# EAGLE design SparkX_EZ_ESP32 (EAGLE 9.6.2)
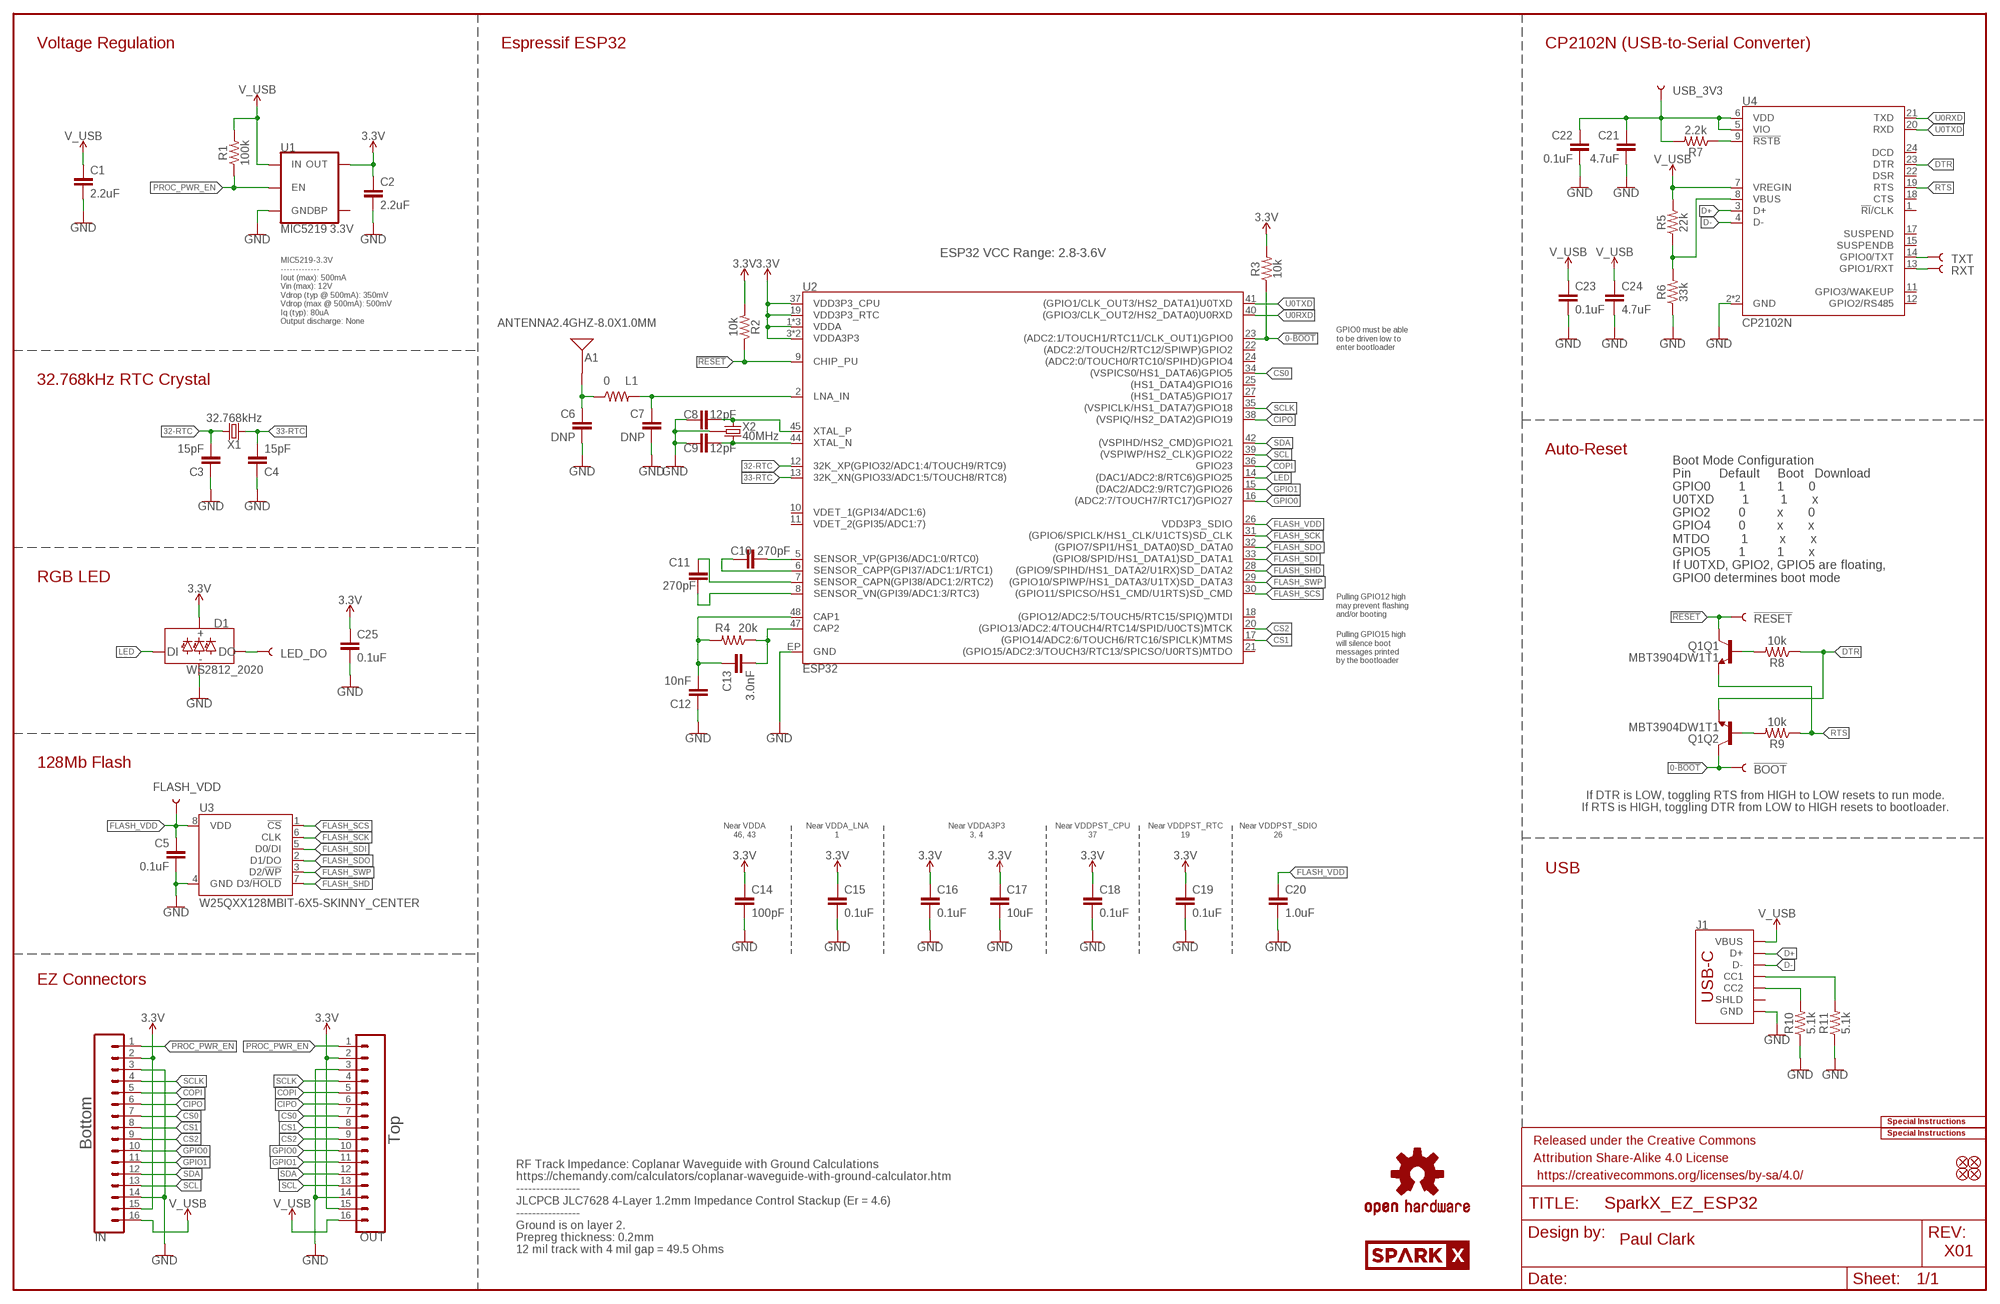
[diagram p0: schematic, sheet 1]

## Parts
!BOOT!  TEST-POINT3X4  [PAD.03X.04]
!RESET!  TEST-POINT3X4  [PAD.03X.04]
A1  ANTENNA2.4GHZ-8.0X1.0MM  [ANT-2.4GHZ-8.0X1.0MM]
C1  2.2uF  2.2UF-0402_TIGHT-10V-10%-X5R  [0402-TIGHT]
C2  2.2uF  2.2UF-0402_TIGHT-10V-10%-X5R  [0402-TIGHT]
C3  15pF  15PF-0402T-50V-5%  [0402-TIGHT]
C4  15pF  15PF-0402T-50V-5%  [0402-TIGHT]
C5  0.1uF  0.1UF-0402T-6.3V-10%-X7R  [0402-TIGHT]
C6  DNP  CAP-0402-TIGHT  [0402-TIGHT]
C7  DNP  CAP-0402-TIGHT  [0402-TIGHT]
C8  12pF  12PF-0402T-50V-5%  [0402-TIGHT]
C9  12pF  12PF-0402T-50V-5%  [0402-TIGHT]
C10  270pF  270PF-0402T-50V-5%  [0402-TIGHT]
C11  270pF  270PF-0402T-50V-5%  [0402-TIGHT]
C12  10nF  10NF-0402T-25V-10%  [0402-TIGHT]
C13  3.0nF  3.0NF-0402T-50V-5%  [0402-TIGHT]
C14  100pF  100PF-0402T-50V-5%  [0402-TIGHT]
C15  0.1uF  0.1UF-0402T-16V-10%  [0402-TIGHT]
C16  0.1uF  0.1UF-0402T-16V-10%  [0402-TIGHT]
C17  10uF  10UF-0402T-6.3V-20%  [0402-TIGHT]
C18  0.1uF  0.1UF-0402T-16V-10%  [0402-TIGHT]
C19  0.1uF  0.1UF-0402T-16V-10%  [0402-TIGHT]
C20  1.0uF  1.0UF-0402T-16V-10%  [0402-TIGHT]
C21  4.7uF  4.7UF-0402_TIGHT-6.3V-20%-X5R  [0402-TIGHT]
C22  0.1uF  0.1UF-0402T-6.3V-10%-X7R  [0402-TIGHT]
C23  0.1uF  0.1UF-0402T-6.3V-10%-X7R  [0402-TIGHT]
C24  4.7uF  4.7UF-0402_TIGHT-6.3V-20%-X5R  [0402-TIGHT]
C25  0.1uF  0.1UF-0402T-16V-10%  [0402-TIGHT]
D1  WS2812_2020  [WS2812-2020]
FD1  FIDUCIALUFIDUCIAL  [FIDUCIAL-MICRO]
FD2  FIDUCIALUFIDUCIAL  [FIDUCIAL-MICRO]
FD3  FIDUCIALUFIDUCIAL  [FIDUCIAL-MICRO]
FD4  FIDUCIALUFIDUCIAL  [FIDUCIAL-MICRO]
FLASH_VDD  TEST-POINT3X4  [PAD.03X.04]
FRAME1  FRAME-LEDGER  [CREATIVE_COMMONS]
IN  CONN_16FPC_16_0.5MM  [FPC_16_0.5MM]
J1  USB_C_4-LAYER_PADS  [USB-C-16P_4LAYER-PADS]
L1  0  0OHM-0402T-1/10W  [0402-TIGHT]
LED_DO  TEST-POINT3X4  [PAD.03X.04]
LOGO1  SPECIAL_INSTRUCTIONS-ORDERING  [ORDERING_INSTRUCTIONS]
LOGO2  OSHW-LOGOMINI  [OSHW-LOGO-MINI]
LOGO3  OSHW-LOGOMINI  [OSHW-LOGO-MINI]
LOGO4  SPECIAL_INSTRUCTIONS-PRODUCTION  [PRODUCTION_INSTRUCTIONS]
OUT  CONN_16FPC_16_0.5MM  [FPC_16_0.5MM]
Q1  MBT3904DW1T1  TRANS_NPN_DUAL-MBT3904DW1T1  [SC70-6]
R1  100k  100KOHM-0402T-1/16W-1%  [0402-TIGHT]
R2  10k  10KOHM-0402T-1/16W-1%  [0402-TIGHT]
R3  10k  10KOHM-0402T-1/16W-1%  [0402-TIGHT]
R4  20k  20KOHM-0402T-1/16W-1%  [0402-TIGHT]
R5  22k  22KOHM-0402_TIGHT-1/10W-1%  [0402-TIGHT]
R6  33k  33KOHM-0402T-1/16W-1%  [0402-TIGHT]
R7  2.2k  2.2KOHM-0402T-1/16W-1%  [0402-TIGHT]
R8  10k  10KOHM-0402T-1/16W-1%  [0402-TIGHT]
R9  10k  10KOHM-0402T-1/16W-1%  [0402-TIGHT]
R10  5.1k  5.1KOHM-0402T-1/16W-1%  [0402-TIGHT]
R11  5.1k  5.1KOHM-0402T-1/16W-1%  [0402-TIGHT]
RXT  TEST-POINT3X4  [PAD.03X.04]
TXT  TEST-POINT3X4  [PAD.03X.04]
U1  MIC5219 3.3V  V_REG_MIC52193.3V  [SOT23-5]
U2  ESP32  [QFN48-0.4MM]
U3  W25QXX128MBIT-6X5-SKINNY_CENTER  [WSON-8-6X5-SKINNY_CENTERPAD]
U4  CP2102N  [QFN24]
U$1  SPARKX-LOGO3  [SPARKX-SMALL]
U$4  SPARKX-LOGO3  [SPARKX-SMALL]
USB_3V3  TEST-POINT3X4  [PAD.03X.04]
X1  32.768kHz  CRYSTAL-32.768KHZSMD-3.2X1.5  [CRYSTAL-SMD-3.2X1.5MM]
X2  40MHz  CRYSTAL-40MHZ-SMD-2X2.5MM  [CRYSTAL-SMD-2X2.5MM]

## Nets
0-!BOOT!: !BOOT!.1 Q1.6(Q2:C) R3.1 U2.23((ADC2:1/TOUCH1/RTC11/CLK_OUT1)GPIO0)
1: C11.1 U2.7(SENSOR_CAPN(GPI38/ADC1:2/RTC2))
3: C10.2 U2.5(SENSOR_VP(GPI36/ADC1:0/RTC0))
3.3V: C2.1 C14.1 C15.1 C16.1 C17.1 C18.1 C19.1 C25.1 D1.VCC IN.2 IN.15 OUT.2 OUT.15 R2.2 R3.2 U1.5(OUT) U2.1(VDDA) U2.3(VDDA3P3) U2.4(VDDA3P3) U2.19(VDD3P3_RTC) U2.37(VDD3P3_CPU) U2.43(VDDA) U2.46(VDDA)
6: C10.1 U2.6(SENSOR_CAPP(GPI37/ADC1:1/RTC1))
32-RTC: C3.2 U2.12(32K_XP(GPIO32/ADC1:4/TOUCH9/RTC9)) X1.P$1
33-RTC: C4.2 U2.13(32K_XN(GPIO33/ADC1:5/TOUCH8/RTC8)) X1.P$2
!RESET: !RESET!.1 Q1.3(Q1:C) R2.1 U2.9(CHIP_PU)
CAP_10N1: C12.2 C13.1 R4.2 U2.48(CAP1)
CIPO: IN.6 OUT.6 U2.38((VSPIQ/HS2_DATA2)GPIO19)
COPI: IN.5 OUT.5 U2.36(GPIO23)
CS0: IN.7 OUT.7 U2.34((VSPICS0/HS1_DATA6)GPIO5)
CS1: IN.8 OUT.8 U2.17((GPIO14/ADC2:6/TOUCH6/RTC16/SPICLK)MTMS)
CS2: IN.9 OUT.9 U2.20((GPIO13/ADC2:4/TOUCH4/RTC14/SPID/U0CTS)MTCK)
D+: J1.A6(D+) J1.B6(D+) U4.3(D+)
D-: J1.A7(D-) J1.B7(D-) U4.4(D-)
DTR: Q1.1(Q2:E) R8.1 U4.23(DTR)
FLASH_SCK: U2.31((GPIO6/SPICLK/HS1_CLK/U1CTS)SD_CLK) U3.6(CLK)
FLASH_SCS: U2.30((GPIO11/SPICSO/HS1_CMD/U1RTS)SD_CMD) U3.1(!CS!)
FLASH_SDI: U2.33((GPIO8/SPID/HS1_DATA1)SD_DATA1) U3.5(D0/DI)
FLASH_SDO: U2.32((GPIO7/SPI1/HS1_DATA0)SD_DATA0) U3.2(D1/DO)
FLASH_SHD: U2.28((GPIO9/SPIHD/HS1_DATA2/U1RX)SD_DATA2) U3.7(D3/!HOLD!)
FLASH_SWP: U2.29((GPIO10/SPIWP/HS1_DATA3/U1TX)SD_DATA3) U3.3(D2/!WP!)
FLASH_VDD: C5.1 C20.1 FLASH_VDD.1 U2.26(VDD3P3_SDIO) U3.8(VDD)
GND: C1.2 C2.2 C3.1 C4.1 C5.2 C6.2 C7.2 C8.1 C9.1 C12.1 C14.2 C15.2 C16.2 C17.2 C18.2 C19.2 C20.2 C21.2 C22.2 C23.2 C24.2 C25.2 D1.GND IN.3 IN.14 J1.GND J1.GND2(GND) OUT.3 OUT.14 R6.1 R10.1 R11.1 U1.2(GND) U2.EP(GND) U3.4(GND) U4.2(GND) U4.PAD(GND) X2.P2(GND) X2.P4(GND)
GPIO0: IN.10 OUT.10 U2.16((ADC2:7/TOUCH7/RTC17)GPIO27)
GPIO1: IN.11 OUT.11 U2.15((DAC2/ADC2:9/RTC7)GPIO26)
LED: D1.DI U2.14((DAC1/ADC2:8/RTC6)GPIO25)
N$1: J1.A5(CC1) R11.2
N$2: J1.B5(CC2) R10.2
N$3: C11.2 U2.8(SENSOR_VN(GPI39/ADC1:3/RTC3))
N$4: D1.DO LED_DO.1
N$45: Q1.5(Q1:B) R8.2
N$46: Q1.2(Q2:B) R9.2
N$47: C8.2 U2.45(XTAL_P) X2.P1
N$48: C9.2 U2.44(XTAL_N) X2.P3
N$50: C13.2 R4.1 U2.47(CAP2)
N$51: R5.1 R6.2 U4.8(VBUS)
N$52: R7.1 U4.9(!RSTB)
N$53: A1.FEED(SIGNAL) C6.1 L1.1
N$54: C7.1 L1.2 U2.2(LNA_IN)
PROC_PWR_EN: IN.1 OUT.1 R1.1 U1.3(EN)
RTS: Q1.4(Q1:E) R9.1 U4.19(RTS)
RXT: RXT.1 U4.13(GPIO1/RXT)
SCL: IN.13 OUT.13 U2.39((VSPIWP/HS2_CLK)GPIO22)
SCLK: IN.4 OUT.4 U2.35((VSPICLK/HS1_DATA7)GPIO18)
SDA: IN.12 OUT.12 U2.42((VSPIHD/HS2_CMD)GPIO21)
TXT: TXT.1 U4.14(GPIO0/TXT)
U0RXD: U2.40((GPIO3/CLK_OUT2/HS2_DATA0)U0RXD) U4.21(TXD)
U0TXD: U2.41((GPIO1/CLK_OUT3/HS2_DATA1)U0TXD) U4.20(RXD)
USB_3V3: C21.1 C22.1 R7.2 U4.5(VIO) U4.6(VDD) USB_3V3.1
V_USB: C1.1 C23.1 C24.1 IN.16 J1.VBUS1(VBUS) J1.VBUS2(VBUS) OUT.16 R1.2 R5.2 U1.1(IN) U4.7(VREGIN)
Unconnected: J1.SHLD1(SHLD) J1.SHLD2(SHLD) J1.SHLD3(SHLD) J1.SHLD4(SHLD) U1.4(BP) U2.10(VDET_1(GPI34/ADC1:6)) U2.11(VDET_2(GPI35/ADC1:7)) U2.18((GPIO12/ADC2:5/TOUCH5/RTC15/SPIQ)MTDI) U2.21((GPIO15/ADC2:3/TOUCH3/RTC13/SPICSO/U0RTS)MTDO) U2.22((ADC2:2/TOUCH2/RTC12/SPIWP)GPIO2) U2.24((ADC2:0/TOUCH0/RTC10/SPIHD)GPIO4) U2.25((HS1_DATA4)GPIO16) U2.27((HS1_DATA5)GPIO17) U4.1(!RI!/CLK) U4.11(GPIO3/WAKEUP) U4.12(GPIO2/RS485) U4.15(SUSPENDB) U4.17(SUSPEND) U4.18(CTS) U4.22(DSR) U4.24(DCD)

## Notes on the sheet
- Voltage Regulation | Espressif ESP32 | CP2102N (USB-to-Serial Converter)
- MIC5219-3.3V
  -------------
  Iout (max): 500mA 
  Vin (max): 12V
  Vdrop (typ @ 500mA): 350mV
  Vdrop (max @ 500mA): 500mV
  Iq (typ): 80uA
  Output discharge: None
- ESP32 VCC Range: 2.8-3.6V
- GPIO0 must be able
  to be driven low to 
  enter bootloader
- 32.768kHz RTC Crystal
- Auto-Reset
- RGB LED
- Boot Mode Configuration
  Pin        Default     Boot   Download
  GPIO0        1         1       0
  U0TXD        1         1       x
  GPIO2        0         x       0
  GPIO4        0         x       x
  MTDO         1         x       x
  GPIO5        1         1       x
  If U0TXD, GPIO2, GPIO5 are floating, 
  GPIO0 determines boot mode
- Pulling GPIO12 high
  may prevent flashing
  and/or booting
- Pulling GPIO15 high
  will silence boot
  messages printed
  by the bootloader
- 128Mb Flash
- If DTR is LOW, toggling RTS from HIGH to LOW resets to run mode.
  If RTS is HIGH, toggling DTR from LOW to HIGH resets to bootloader.
- Near VDDA
  46, 43
- Near VDDA_LNA
  1
- Near VDDA3P3
  3, 4
- Near VDDPST_CPU
  37
- Near VDDPST_RTC
  19
- Near VDDPST_SDIO
  26
- USB
- EZ Connectors
- Top
- Bottom
- RF Track Impedance: Coplanar Waveguide with Ground Calculations
  https://chemandy.com/calculators/coplanar-waveguide-with-ground-calculator.htm
  ----------------
  JLCPCB JLC7628 4-Layer 1.2mm Impedance Control Stackup (Er = 4.6)
  ----------------
  Ground is on layer 2.
  Prepreg thickness: 0.2mm
  12 mil track with 4 mil gap = 49.5 Ohms
- Paul Clark
- X01

## Library data of the parts
!BOOT! !RESET! FLASH_VDD LED_DO RXT TXT USB_3V3 = SparkFun-Connectors:TEST-POINT: SparkFun Test Points Bare copper test points for troubleshooting or In-Circuit-Testing. These are used by our Production team for verifying production board runs using pogo-pins on test beds. SparkFun Products: SparkFun LSM9DS1 Breakout <https://www.sparkfun.com/products/13284> SparkFun PSOC <https://www.sparkfun.com/products/13714> SparkFun Load Cell Amplifier <https://www.sparkfun.com/products/13879>
A1 = SparkFun-RF:ANTENNA: Single-ended Antennae 2.4GHz and antennae with just one terminal. These are all chip antennae. 2.4GHz (WiFi/BT/ZigBee) Antennae ANT-2.4GHZ-6.5X2.2MM - 6.5 x 2.2 mm chip antenna. (SparkFun Product <https://www.sparkfun.com/products/144>) ANT-2.4GHZ8.0X1.0MM - 8.0 x 1.0 mm chip antenna. (Datasheet <http://www.mouser.com/ds/2/611/antenna_2500at44m0400-242425.pdf>) ANT-2.4GHZ9.5X2.0MM - 9.5 x 2.0 mm chip antenna. (SparkFun Product <https://www.sparkfun.com/products/9025>); PROD_ID: ANT-14377
C1 C2 = SparkFun-Capacitors:2.2UF: 2.2µF ceramic capacitors A capacitor is a passive two-terminal electrical component used to store electrical energy temporarily in an electric field.; PROD_ID: CAP-14232
C3 C4 = SparkFun-Capacitors:15PF: 15pF ceramic capacitors A capacitor is a passive two-terminal electrical component used to store electrical energy temporarily in an electric field.; PROD_ID: CAP-13063
C5 C22 C23 = SparkFun-Capacitors:0.1UF: 0.1µF ceramic capacitors A capacitor is a passive two-terminal electrical component used to store electrical energy temporarily in an electric field.; PROD_ID: CAP-14993
C6 C7 = SparkFun-Capacitors:CAP
C8 C9 = SparkFun-Capacitors:12PF: 12pF ceramic capacitors A capacitor is a passive two-terminal electrical component used to store electrical energy temporarily in an electric field.; PROD_ID: CAP-14665
C10 C11 = SparkFun-Capacitors:270PF: 270pF/0.27nF ceramic capacitors A capacitor is a passive two-terminal electrical component used to store electrical energy temporarily in an electric field.; PROD_ID: CAP-15129
C12 = SparkFun-Capacitors:10NF: 0.01uF/10nF/10,000pF ceramic capacitors A capacitor is a passive two-terminal electrical component used to store electrical energy temporarily in an electric field. CAP-09321; PROD_ID: CAP-14847
C13 = SparkFun-Capacitors:3.0NF: 3.0nF (3nF, 3000pF) ceramic capacitors A capacitor is a passive two-terminal electrical component used to store electrical energy temporarily in an electric field.; PROD_ID: CAP-15130
C14 = SparkFun-Capacitors:100PF: 100pF/0.1nF ceramic capacitors A capacitor is a passive two-terminal electrical component used to store electrical energy temporarily in an electric field.; PROD_ID: CAP-13458
C15 C16 C18 C19 C25 = SparkFun-Capacitors:0.1UF: 0.1µF ceramic capacitors A capacitor is a passive two-terminal electrical component used to store electrical energy temporarily in an electric field.; PROD_ID: CAP-12416
C17 = SparkFun-Capacitors:10UF: 10.0µF ceramic capacitors A capacitor is a passive two-terminal electrical component used to store electrical energy temporarily in an electric field.; PROD_ID: CAP-14848
C20 = SparkFun-Capacitors:1.0UF: 1µF ceramic capacitors A capacitor is a passive two-terminal electrical component used to store electrical energy temporarily in an electric field.; PROD_ID: CAP-12417
C21 C24 = SparkFun-Capacitors:4.7UF: 4.7µF ceramic capacitors A capacitor is a passive two-terminal electrical component used to store electrical energy temporarily in an electric field.; PROD_ID: CAP-14240
D1 = SparkFun-LED:WS2812: Addressable RGB LED - 1 Wire Common names: WS2812, SK6812, Neopixel, APA-106, etc. SMD LED with built-in controller IC. Color: Red/Green/Blue SparkFun Products: LED-SMD RGB (WS2812) <https://www.sparkfun.com/products/11821> LED - RGB Addressable, PTH, 5mm Diffused (5 Pack) <https://www.sparkfun.com/products/12986> LED - RGB Addressable, PTH, 5mm Clear (5 Pack) <https://www.sparkfun.com/products/12999> Blynk Board - ESP8266 <https://www.sparkfun.com/products/13794> Datasheet referenced for footprint: WS2812B-PTH <https://cdn.sparkfun.com/datasheets/Components/LED/COM-12877.pdf>; PROD_ID: DIO-15591
FD1-FD4 = SparkFun-Aesthetics:FIDUCIAL: Fiducial Alignment Points Point-of-reference for pick-and-place machines and other optical instruments.
FRAME1 = SparkFun-Aesthetics:FRAME-LEDGER: Schematic Frame - Ledger Standard 11x14 US Ledger frame
IN OUT = SparkFun-Connectors:CONN_16: Multi connection point. Often used as Generic Header-pin footprint for 0.1 inch spaced/style header connections On any of the 0.1 inch spaced packages, you can populate with these: Break Away Headers - Straight <https://www.sparkfun.com/products/116> (PRT-00116) Break Away Male Headers - Right Angle <https://www.sparkfun.com/products/553> (PRT-00553) Female Headers <https://www.sparkfun.com/products/115> (PRT-00115) Break Away Headers - Machine Pin <https://www.sparkfun.com/products/117> (PRT-00117) Break Away Female Headers - Swiss Machine Pin <https://www.sparkfun.com/products/743> (PRT-00743) For SCREWTERMINALS and SPRING TERMINALS visit here: Screw Terimnals on SparkFun.com <https://www.sparkfun.com/search/results?term=Screw+Terminals> (5mm/3.5mm/2.54mm spacing) This device is also useful as a general connection point to wire up your design to another part of your project. Our various solder wires solder well into these plated through hole pads. Hook-Up Wire - Assortment (Stranded, 22 AWG) <https://www.sparkfun.com/products/11375> (PRT-11375) Hook-Up Wire - Assortment (Solid Core, 22 AWG) <https://www.sparkfun.com/products/11367> (PRT-11367) View the entire wire category on our website here <https://www.sparkfun.com/categories/141> Special notes: Molex polarized connector foot print use with SKU : PRT-08231 with associated crimp pins and housings. 1MM SMD Version SKU: PRT-10208 NOTES ON THE VARIANTS LOCK and LOCK_LONGPADS... This footprint was designed to help hold the alignment of a through-hole component (i.e. 6-pin header) while soldering it into place. You may notice that each hole has been shifted either up or down by 0.005 of an inch from it's more standard position (which is a perfectly straight line). This slight alteration caused the pins (the squares in the middle) to touch the edges of the holes. Because they are alternating, it causes a "brace" to hold the component in place. 0.005 has proven to be the perfect amount of "off-center" position when using our standard breakaway headers. Although looks a little odd when you look at the bare footprint, once you have a header in there, the alteration is very hard to notice. Also,if you push a header all the way into place, it is covered up entirely on the bottom side.; PROD_ID: CONN-16066
J1 = SparkFun-Connectors:USB_C: USB Type C 16Pin Connector Super Speed pins not available on the 16-pin purely SMD connector so this part is best for USB 2.0 implementations. D1 and D2 are tied together enabling D+/- no matter which way the cable is plugged into the connector. The two channel configuration pins (CC1/2) are exposed. These are normally connected to ground via 5.1k resistors but can be reconfigured for high current/high power applications. **4-LAYER BOARD WARNING!!** If designing 4-layer board, make sure to select the variant _4-LAYER-ISOLATED. The linked footprint (USB-C-16-4LAYER-ISOLATED) includes some very necessary cutout polygons in the inner layers (2 and 15). This prevents the PTH mounting shield legs on the USB connector from electrically connecting any other polygons on the inner layers (usually VCC and GND).; PROD_ID: CONN-14122
L1 = SparkFun-Resistors:0OHM: 0Ω resistor A resistor is a passive two-terminal electrical component that implements electrical resistance as a circuit element. Resistors act to reduce current flow, and, at the same time, act to lower voltage levels within circuits. - Wikipedia; PROD_ID: RES-14244
LOGO1 LOGO4 = SparkFun-Aesthetics:SPECIAL_INSTRUCTIONS: Special Ordering/Production Instructions Alert Symbol for special PCB ordering instructions or unique production process warnings. Ordering Instructions Production Instructions Types of information that should be added to box: Copper weight Soldermask color Silk color PCB thickness Number of layers PCB Standard: 1.6mm FR4 1 oz copper immersion silver plating red soldermask white silkscreen Types of information that should be added to box: Special wash requirements Depaneling instructions Humidification Glue curing Default text settings: 0.07 inch 9% ratio 50% line distance
LOGO2 LOGO3 = SparkFun-Aesthetics:OSHW-LOGO: Open-Source Hardware (OSHW) Logo This logo indicates the piece of hardware it is found on incorporates a OSHW license and/or adheres to the definition of open source hardware found here: http://freedomdefined.org/OSHW
Q1 = SparkFun-DiscreteSemi:TRANS_NPN_DUAL: Dual NPN Transistors in Single Package The MBT3904W1 puts two general purpose 3904 NPN transistors in a single package. Datasheet <http://www.onsemi.com/pub_link/Collateral/MBT3904DW1T1-D.PDF> SparkFun Products: SparkFun ESP32 Thing <https://www.sparkfun.com/products/13907>; PROD_ID: TRANS-13337
R1 = SparkFun-Resistors:100KOHM: 100kΩ resistor A resistor is a passive two-terminal electrical component that implements electrical resistance as a circuit element. Resistors act to reduce current flow, and, at the same time, act to lower voltage levels within circuits. - Wikipedia; PROD_ID: RES-13495
R2 R3 R8 R9 = SparkFun-Resistors:10KOHM: 10kΩ resistor A resistor is a passive two-terminal electrical component that implements electrical resistance as a circuit element. Resistors act to reduce current flow, and, at the same time, act to lower voltage levels within circuits. - Wikipedia; PROD_ID: RES-14241
R4 = SparkFun-Resistors:20KOHM: 20kΩ resistor A resistor is a passive two-terminal electrical component that implements electrical resistance as a circuit element. Resistors act to reduce current flow, and, at the same time, act to lower voltage levels within circuits. - Wikipedia; PROD_ID: RES-15131
R5 = SparkFun-Resistors:22KOHM: 22kΩ resistor A resistor is a passive two-terminal electrical component that implements electrical resistance as a circuit element. Resistors act to reduce current flow, and, at the same time, act to lower voltage levels within circuits. - Wikipedia; PROD_ID: RES-14281
R6 = SparkFun-Resistors:33KOHM: 33kΩ resistor A resistor is a passive two-terminal electrical component that implements electrical resistance as a circuit element. Resistors act to reduce current flow, and, at the same time, act to lower voltage levels within circuits. - Wikipedia; PROD_ID: RES-15128
R7 = SparkFun-Resistors:2.2KOHM: 2.2kΩ resistor A resistor is a passive two-terminal electrical component that implements electrical resistance as a circuit element. Resistors act to reduce current flow, and, at the same time, act to lower voltage levels within circuits. - Wikipedia; PROD_ID: RES-14341
R10 R11 = SparkFun-Resistors:5.1KOHM; PROD_ID: RES-14340
U1 = SparkFun-IC-Power:V_REG_MIC5219: V_REG MIC5219 Standard 3.3V and 5V 500mA LDO voltage regulator in SOT-23 layout. Micrel part MIC5219. BP (by-pass) pin is used to lower output noise with 470pF cap, may be left open.; PROD_ID: VREG-09872
U2 = SparkFun-RF:ESP32: Espressif ESP32 WiFi-compatible SoC microcontroller. Bluetooth Low energy support (BLE, BT4.0, Bluetooth Smart) 28 GPIO pins Dual-core Tensilica LX6 microprocessor Hardware accelerated encryption (AES, SHA2, ECC, RSA-4096) 4MB Flash memory 520kB internal SRAM Datasheet <https://cdn.sparkfun.com/datasheets/IoT/esp32_datasheet_en.pdf> SparkFun Products: SparkFun ESP32 Thing <https://www.sparkfun.com/products/13907>; PROD_ID: IC-13338
U3 = SparkFun-IC-Memory:W25QXX; PROD_ID: IC-15107
U4 = SparkFun-IC-Comms:CP2102N; PROD_ID: IC-14020
U$1 U$4 = SparkX:SPARKX-LOGO
X1 = SparkFun-Clocks:CRYSTAL-32.768KHZ: 32.768kHz Crystal Frequency: 32.768kHz Frequency Stability: ±20ppm Load Capacitance: 12.5pF (PTH-2X6 & SMD-3.2X1.5), 6pF (SMD-2X6) SparkFun Products: SparkFun BigTime Watch Kit <https://www.sparkfun.com/products/11734> SparkFun nRF52832 Breakout <https://www.sparkfun.com/products/13990> SparkFun Real Time Clock Module <https://www.sparkfun.com/products/12708>; PROD_ID: XTAL-13062
X2 = SparkFun-Clocks:CRYSTAL-40MHZ: 40MHz Crystal w/ Ground Pin Digikey Example <https://www.digikey.com/product-detail/en/epson/FA-20H-40-0000MF10Z-K3/SER4045CT-ND/5175137> Frequency: 40MHz Frequency Stability: ±10ppm Frequency Tolerance: ±10ppm Load Capacitance: 10pF; PROD_ID: XTAL-15127; VALUE: 40MHZ

## Net classes
1 Power: width 0.305 mm
2 3.3V: width 0.508 mm

## Board
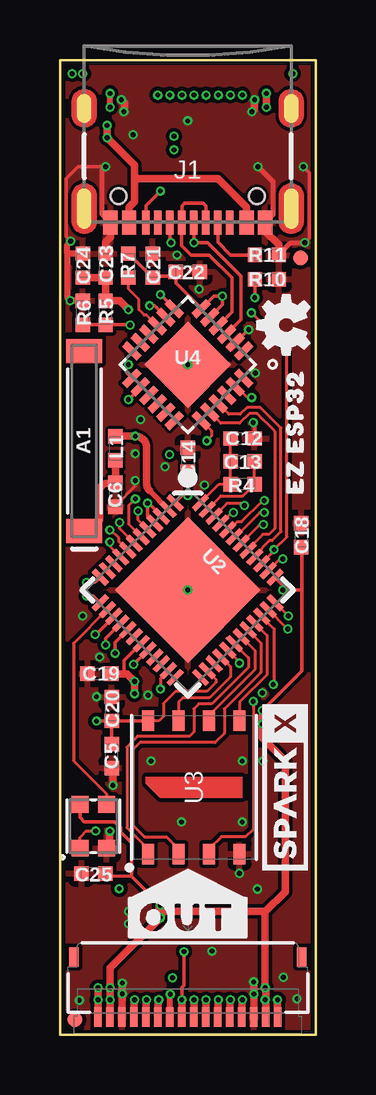
[diagram p1: board, top side]
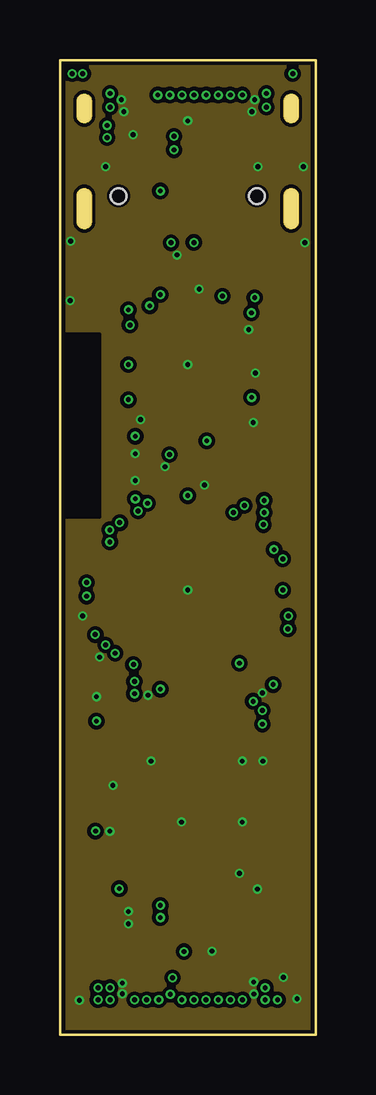
[diagram p2: board, inner layer Route2]
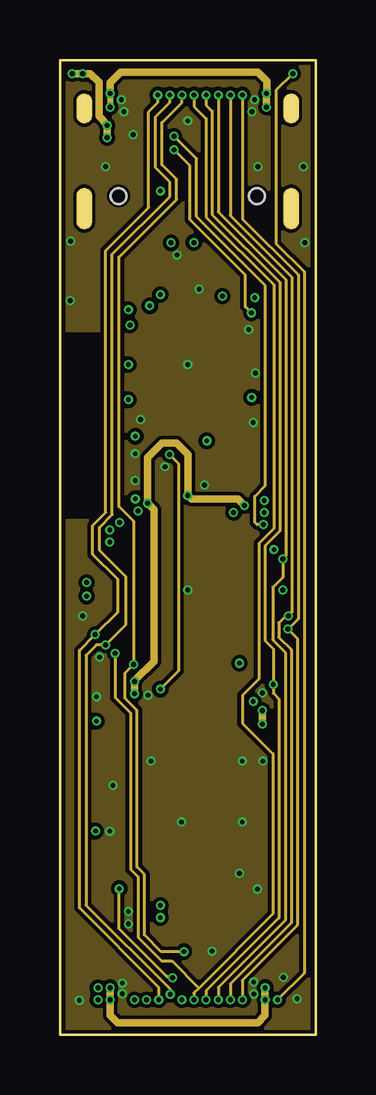
[diagram p3: board, inner layer Route15]
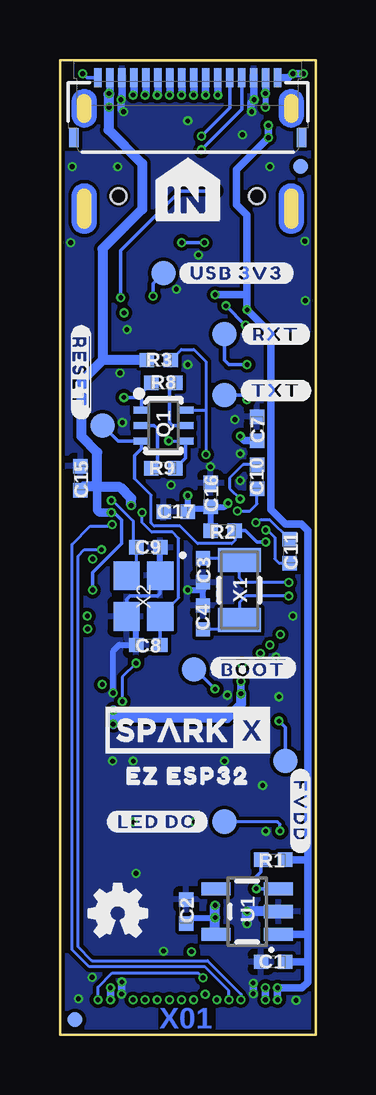
[diagram p4: board, bottom side, seen from below]

Size 10.67 x 40.64 mm. Coordinates in mm from the lower left corner, seen from the top.
Outline: 0,40.64 0,0 10.67,0 10.67,40.64 0,40.64
Copper layers (1+2*15+16): Top 0.035mm / dielectric 0.2mm / Route2 0.0175mm / dielectric 0.265mm / Route15 0.0175mm / dielectric 0.2mm / Bottom 0.035mm
Design rules "SparkFun-4_layer-Impedance_Control-JLCPCB-JLC7628 *": minimum track width 5mil, minimum drill 0.2mm, track to track 5mil, track to pad 5mil, pad to pad 5mil, via to via 5mil, smd to smd 0mil, copper to edge 5mil, drill to drill 5mil, minimum pad ring 3.5mil, minimum via ring 3.5mil, stop-mask expansion 2.5mil, vias tented up to drill 25mil, thermal gap 10mil

### Footprints (pad centres in the part's own frame; a part is rotated, then mirrored left to right if it is on the bottom)
PAD.03X.04 = smd 1.016 x 1.016: 1 0,0
ANT-2.4GHZ-8.0X1.0MM = smd 1 x 1.5: FEED -3.75,0; NC 3.75,0
0402-TIGHT = smd 0.6 x 0.6: 1 -0.5,0; 2 0.5,0
WS2812-2020 = smd 0.7 x 0.7: DI -0.915,0.55; DO 0.915,-0.55; GND 0.915,0.55; VCC -0.915,-0.55
FIDUCIAL-MICRO = smd 0.635 x 0.635: 1 0,0
FPC_16_0.5MM = smd 0.3 x 0.8: 1 -3.75,1.35; 2 -3.25,1.35; 3 -2.75,1.35; 4 -2.25,1.35; 5 -1.75,1.35; 6 -1.25,1.35; 7 -0.75,1.35; 8 -0.25,1.35; 9 0.25,1.35; 10 0.75,1.35; 11 1.25,1.35; 12 1.75,1.35; 13 2.25,1.35; 14 2.75,1.35; 15 3.25,1.35; 16 3.75,1.35 | smd 0.4 x 0.8: MP1 -4.75,-1.15; MP2 4.75,-1.15
USB-C-16P_4LAYER-PADS = smd 0.3 x 1: A5 -1.25,-0.34; A6 -0.25,-0.34; A7 0.25,-0.34; A8 1.25,-0.34; B5 1.75,-0.34; B6 0.75,-0.34; B7 -0.75,-0.34; B8 -1.75,-0.34 | smd 0.6 x 1: GND -3.225,-0.34; GND2 3.225,-0.34; VBUS1 -2.45,-0.34; VBUS2 2.45,-0.34 | drill 0.4 pad 0.6 long: SHLD1 -4.318,-0.915; SHLD2 4.318,-0.915; SHLD3 -4.318,-5.095; SHLD4 4.318,-5.095 | hole 0.65: -2.89,-1.445; 2.89,-1.445
SC70-6 = smd 0.3 x 0.66: 1 -0.65,-0.92; 2 0,-0.92; 3 0.65,-0.92; 4 0.65,0.92; 5 0,0.92; 6 -0.65,0.92
SOT23-5 = smd 0.55 x 1.2: 1 -0.95,-1.3; 2 0,-1.3; 3 0.95,-1.3; 4 0.95,1.3; 5 -0.95,1.3
QFN48-0.4MM = smd 0.8 x 0.23: 1 -2.95,2.2; 2 -2.95,1.8; 3 -2.95,1.4; 4 -2.95,1; 5 -2.95,0.6; 6 -2.95,0.2; 7 -2.95,-0.2; 8 -2.95,-0.6; 9 -2.95,-1; 10 -2.95,-1.4; 11 -2.95,-1.8; 12 -2.95,-2.2; 25 2.95,-2.2; 26 2.95,-1.8; 27 2.95,-1.4; 28 2.95,-1; 29 2.95,-0.6; 30 2.95,-0.2; 31 2.95,0.2; 32 2.95,0.6; 33 2.95,1; 34 2.95,1.4; 35 2.95,1.8; 36 2.95,2.2 | smd 0.23 x 0.8: 13 -2.2,-2.95; 14 -1.8,-2.95; 15 -1.4,-2.95; 16 -1,-2.95; 17 -0.6,-2.95; 18 -0.2,-2.95; 19 0.2,-2.95; 20 0.6,-2.95; 21 1,-2.95; 22 1.4,-2.95; 23 1.8,-2.95; 24 2.2,-2.95; 37 2.2,2.95; 38 1.8,2.95; 39 1.4,2.95; 40 1,2.95; 41 0.6,2.95; 42 0.2,2.95; 43 -0.2,2.95; 44 -0.6,2.95; 45 -1,2.95; 46 -1.4,2.95; 47 -1.8,2.95; 48 -2.2,2.95 | smd 4.3 x 4.3: EP 0,0
WSON-8-6X5-SKINNY_CENTERPAD = smd 0.85 x 0.5: 1 -2.775,1.905; 2 -2.775,0.635; 3 -2.775,-0.635; 4 -2.775,-1.905; 5 2.775,-1.905; 6 2.775,-0.635; 7 2.775,0.635; 8 2.775,1.905
QFN24 = smd 0.85 x 0.3: 1 -2.05,1.25; 2 -2.05,0.75; 3 -2.05,0.25; 4 -2.05,-0.25; 5 -2.05,-0.75; 6 -2.05,-1.25; 13 2.05,-1.25; 14 2.05,-0.75; 15 2.05,-0.25; 16 2.05,0.25; 17 2.05,0.75; 18 2.05,1.25 | smd 0.3 x 0.85: 7 -1.25,-2.05; 8 -0.75,-2.05; 9 -0.25,-2.05; 10 0.25,-2.05; 11 0.75,-2.05; 12 1.25,-2.05; 19 1.25,2.05; 20 0.75,2.05; 21 0.25,2.05; 22 -0.25,2.05; 23 -0.75,2.05; 24 -1.25,2.05 | smd 2.55 x 2.55: PAD 0,0
CRYSTAL-SMD-3.2X1.5MM = smd 1 x 1.8: P$1 -1.25,0; P$2 1.25,0
CRYSTAL-SMD-2X2.5MM = smd 1.2 x 1.1: P1 0.846,0.69; P2 -0.854,0.69; P3 -0.854,-0.71; P4 0.846,-0.71

### Placement (x,y rotation side)
!BOOT!  5.08,15.24 0 bottom
!RESET!  8.89,25.4 0 bottom
A1  1.02,24.77 90 top
C1  1.78,3.05 180 bottom
C2  5.4,5.14 90 bottom
C3  4.7,19.37 90 bottom
C4  4.7,17.4 270 bottom
C5  2.16,11.62 270 top
C6  2.32,22.51 270 top
C7  2.44,25.27 90 bottom
C8  6.99,16.26 0 bottom
C9  6.99,20.32 180 bottom
C10  2.44,23.27 270 bottom
C11  1.08,20.16 270 bottom
C12  7.62,24.86 180 top
C13  7.62,23.91 0 top
C14  5.33,23.97 90 top
C15  9.81,23.21 90 bottom
C16  4.38,22.51 90 bottom
C17  5.84,21.81 180 bottom
C18  10.06,20.83 90 top
C19  1.65,15.05 180 top
C20  2.16,13.59 90 top
C21  3.87,32.07 90 top
C22  5.33,31.81 0 top
C23  1.91,32.07 90 top
C24  0.95,32.07 90 top
C25  1.4,6.73 180 top
D1  1.4,8.7 270 top
FD1  10.03,32.38 0 top
FD2  0.64,36.2 0 bottom
FD3  0.64,0.64 0 top
FD4  10.03,0.64 0 bottom
FLASH_VDD  1.27,11.43 0 bottom
FRAME1  48.26,-41.91 0 top  (outside the outline)
IN  5.33,38.54 0 bottom
J1  5.33,33.53 180 top
L1  2.32,24.45 90 top
LED_DO  3.81,8.89 0 bottom
LOGO1  20.32,71.12 0 top  (outside the outline)
LOGO2  9.43,29.59 90 top
LOGO3  8.26,5.08 0 bottom
LOGO4  20.32,17.78 0 top  (outside the outline)
OUT  5.33,2.1 180 top
Q1  6.35,25.4 270 bottom
R1  1.78,7.3 0 bottom
R2  3.87,21.02 180 bottom
R3  6.54,28.13 180 bottom
R4  7.62,22.96 180 top
R5  1.91,30.1 90 top
R6  0.95,30.1 270 top
R7  2.86,32.07 90 top
R8  6.35,27.18 0 bottom
R9  6.35,23.62 180 bottom
R10  8.64,31.5 180 top
R11  8.64,32.51 180 top
RXT  3.81,29.21 0 bottom
TXT  3.81,26.67 0 bottom
U1  2.86,5.14 90 bottom
U2  5.33,18.54 315 top
U3  5.59,10.32 90 top
U4  5.33,27.94 225 top
U$1  9.4,10.32 90 top
U$2  [EZ_ESP320]  9.81,25.15 90 top
U$3  [EZ_ESP320]  5.33,10.79 0 bottom
U$4  5.33,12.7 0 bottom
U$5  [#TXT#0]  1.65,26.86 0 bottom
U$6  [#RXT#0]  1.65,29.21 0 bottom
U$7  [##BOOT##0]  2.6,15.3 0 bottom
U$8  [##RESET##0]  9.78,27.62 270 bottom
U$9  [#USB_3V3#0]  3.3,31.75 0 bottom
U$10  [#FVDD#0]  0.64,9.33 270 bottom
U$11  [#LED_DO#0]  6.6,8.89 0 bottom
U$12  [#IN#0]  5.33,34.8 0 bottom
U$13  [#OUT#0]  5.33,4.89 0 top
USB_3V3  6.35,31.75 0 bottom
X1  3.17,18.54 270 bottom
X2  7.18,18.29 270 bottom

### Tracks (layer width: path | path; a pad name or v marks a point on that pad's centre or on a via)
0-!BOOT!  (via drill 0.2)
  Top 0.127: U2.23 4.19,14.85 v4.19,14.41
  Route15 0.127: v4.57,24.19 4.95,23.81 4.95,15.18 v4.19,14.41
  Bottom 0.127: R3.1 5.6,28.57 5.08,28.57 4.57,28.07 4.57,26.04 | 4.57,26.04 v4.57,24.19 | Q1.6 4.59,26.05 4.57,26.04
  Bottom 0.152: v4.19,14.41 5.02,15.24 !BOOT!.1
1  (via drill 0.2)
  Top 0.127: U2.7 2.49,21.1 v2.49,21.35
  Bottom 0.127: C11.1 1.1,20.66 1.92,21.48 2.3,21.48 2.43,21.35 v2.49,21.35
3  (via drill 0.2)
  Top 0.127: U2.5 3.26,21.46 v3.26,21.84
  Bottom 0.127: v3.26,21.84 2.73,21.84 2.44,22.13 C10.2
3.3V  (via drill 0.2)
  Top 0.127: U2.43 7.34,20.77 8.35,21.78 v8.52,21.78 | v7.7,22.07 7.61,22.15 6.97,22.15 U2.46 | C14.1 v5.33,22.48 | 2.98,6.6 2.02,6.6 C25.1 | v9.3,18.54
  Top 0.152: U2.3 3.69,22.16 v3.65,22.16 3.65,21.64 U2.4 | U2.1 5.1,22.48 v5.33,22.48 | U2.37 9.3,18.74 v9.3,18.54 10.1,18.54 | D1.VCC 0.85,9.06 1.02,8.89 2.29,8.89 2.53,8.65 2.53,8.46 2.98,8 2.98,6.6 v4.19,5.4 | C18.1 10.1,20.3 10.1,18.54 | 2.67,15.05 2.67,15.06 2.67,15.6 U2.19 | 10.1,18.54 10.1,15.18 v8.45,13.53
  Top 0.254: v2.1,38.67 v2.1,39.24
  Top 0.305: OUT.2 8.58,1.95 v8.56,1.97 8.56,5.13 | OUT.15 2.08,1.45 v2.1,1.46 v2.09,1.46 v2.09,1.97 2.09,2.79 v4.19,4.89 | 8.56,5.13 8.56,5.14 4.19,5.14 | C19.1 2.67,15.05 2.79,15.05 v3.11,14.73 v3.11,14.22 | v8.62,39.24 v8.62,38.67 | 8.56,5.13 9.4,5.97 9.4,11.43 8.45,12.38 v8.45,12.95 v8.45,13.53
  Top 0.406: v4.19,4.89 4.19,5.14 v4.19,5.4
  Route15 0.254: v2.1,39.24 v2.1,38.67
  Route15 0.305: v2.09,1.97 v2.1,1.97 v2.1,1.46 2.1,0.83 2.41,0.51 8.26,0.51 8.56,0.81 v8.56,1.46 v8.56,1.97 | v2.1,39.24 2.1,39.69 2.54,40.13 8.26,40.13 8.64,39.75 8.64,39.26 v8.62,39.24 v8.62,38.67 | v7.7,22.07 7.44,22.33 5.49,22.33 v5.33,22.48 5.33,24.19 4.87,24.66 4.25,24.66 3.65,24.06 v3.65,22.16 3.66,22.16 3.92,21.91 3.92,15.57 3.11,14.77 v3.11,14.73 v3.11,14.22 | v8.45,13.53 v8.45,12.95
  Bottom 0.152: v9.3,18.54 9.3,19.28 8.1,20.49 8.1,21.46 8.41,21.78 v8.52,21.78
  Bottom 0.254: v5.33,22.48 C17.1 5.21,21.94 4.45,21.94 C16.1 | C16.1 4.38,21.03 R2.2 | C16.1 3.8,22.01 v3.65,22.16 | C2.1 5.15,4.89 v4.19,4.89 | v2.1,39.24 v2.1,38.67
  Bottom 0.305: v8.56,1.46 v8.56,1.97 8.57,1.98 | IN.2 8.58,39.27 v8.62,39.24 | v2.1,1.46 v2.1,1.97 v2.09,1.97 | v2.1,39.24 2.08,39.26 IN.15 | v3.11,14.73 v3.11,14.22
  Bottom 0.356: v8.52,21.78 9.01,21.78 9.11,21.87 9.11,22.83
  Bottom 0.406: v8.62,39.24 v8.62,39.23 8.64,39.2 8.64,37.73 7.24,36.32 7.24,34.42 8.89,32.77 8.89,28.13 | R3.2 8.89,28.13 | v4.19,5.4 v4.19,4.89 4.19,4.23 U1.5 | v8.45,13.53 8.45,13.21 | 8.45,13.21 v8.45,12.95 | v3.11,14.22 3.11,13.78 3.68,13.21 8.45,13.21 | 8.89,28.13 9.78,27.24 9.78,24.96 9.11,24.28 9.11,22.86 | 9.11,22.86 9.11,22.83 8.16,22.83 7.7,22.37 v7.7,22.07 | 9.11,22.86 9.66,22.86 C15.1
6  (via drill 0.2)
  Top 0.127: U2.6 2.88,21.28 2.88,22.08 v3.15,22.34
  Bottom 0.127: C10.1 3.02,23.77 3.59,23.21 3.59,22.78 v3.15,22.34
32-RTC  (via drill 0.2)
  Top 0.127: U2.12 1.48,18.86 v1.12,18.86
  Bottom 0.127: C3.2 3.25,19.87 X1.P$1 3.17,19.05 2.98,18.86 v1.12,18.86
33-RTC  (via drill 0.2)
  Top 0.127: U2.13 1.42,18.29 v1.12,18.29
  Bottom 0.127: v1.12,18.29 2.92,18.29 3.17,18.03 X1.P$2 3.57,16.9 C4.2
!RESET  (via drill 0.2)
  Top 0.127: U2.9 2.08,20.38 v2.08,20.55
  Bottom 0.127: R2.1 3.37,20.6 3.49,20.48 4.92,20.48 5.65,21.21 6.73,21.21 6.87,21.34 6.87,22.5 7.56,23.19
  Bottom 0.152: 7.56,23.19 7.56,24.15 7.27,24.43 Q1.3 8.24,24.75 !RESET!.1 | v2.08,20.55 2.45,20.55 2.92,21.02 R2.1
CAP_10N1
  Top 0.127: U2.48 6.64,22.95 R4.2 C13.1 C12.2
CIPO  (via drill 0.2)
  Top 0.127: U2.38 9.18,19.84 v9.3,19.84
  Top 0.305: v6.61,1.46 6.58,1.44 OUT.6
  Route15 0.127: v6.61,39.18 6.61,34.3 9.43,31.48 9.43,19.98 v9.3,19.84 9.3,19.07 8.88,18.66 8.88,16.47 9.4,15.95 9.4,4.77 6.61,1.98 v6.61,1.46
  Bottom 0.305: IN.6 6.58,39.2 v6.61,39.18
COPI  (via drill 0.2)
  Top 0.127: U2.36 v9.53,17.46 | v9.53,17.46
  Top 0.305: v7.11,1.46 7.08,1.43 OUT.5
  Route15 0.127: v7.11,39.18 7.11,34.15 9.68,31.58 9.68,17.62 v9.53,17.46 9.42,17.46 9.13,17.18 9.13,16.57 9.65,16.06 9.65,4.67 7.11,2.13 v7.11,1.46
  Bottom 0.305: IN.5 7.08,39.21 v7.11,39.18
CS0  (via drill 0.2)
  Top 0.127: U2.34 8.93,16.93 8.93,14.64
  Top 0.152: 8.93,14.64 v8.9,14.61
  Top 0.305: OUT.7 6.08,1.45 v6.1,1.46
  Route15 0.127: v6.1,39.18 6.1,38.76 6.35,38.51 6.35,34.2 9.18,31.37 9.18,21 8.56,20.38 8.56,16.43 8.9,16.09 v8.9,14.61 8.9,14.25 9.14,14 9.14,4.88 6.1,1.83 v6.1,1.46
  Bottom 0.305: IN.7 6.08,39.2 v6.1,39.18
CS1  (via drill 0.2)
  Top 0.152: U2.17 2.3,16.36 v2.3,15.91
  Top 0.305: OUT.8 v5.58,1.45 v5.59,1.46
  Route15 0.127: v5.6,39.18 5.6,38.7 6.1,38.19 6.1,34.09 8.92,31.27 8.92,21.11 8.3,20.49 8.3,14.84 7.62,14.16 7.62,12.99 8.89,11.72 8.89,5.05 5.79,1.95 | v5.59,1.46 5.59,1.75 5.79,1.95 | v2.3,15.91 2.3,14.07 2.95,13.42 2.95,6.89 3.26,6.58 3.26,4.06 4.24,3.08 4.67,3.08 5.79,1.95
  Bottom 0.305: IN.8 5.58,39.19 v5.6,39.18
CS2  (via drill 0.2)
  Top 0.152: v5.09,1.46 5.09,1.98 5.17,2.06 v5.17,3.47 | U2.20 v3.08,15.44 v3.07,15.44
  Top 0.305: OUT.9 v5.08,1.46 v5.09,1.46
  Route15 0.127: v5.17,3.47 4.23,3.47 3.53,4.17 3.53,6.69 3.22,7 3.22,13.53 2.72,14.03 2.72,15.09 v3.07,15.44 3.07,21.42 2.46,22.02 2.46,32.43 4.87,34.83 4.87,35.66 4.26,36.27 4.26,38.03 5.09,38.86 v5.09,39.18
  Bottom 0.305: IN.9 v5.08,39.19 v5.09,39.18
D+  (via drill 0.2)
  Top 0.152: v4.64,33.02 4.58,33.07 J1.B6 | J1.A6 v5.59,33.03 6.16,33.03 7.56,31.64 7.56,29.81 U4.3
  Bottom 0.152: v5.59,33.03 v4.65,33.03 v4.64,33.02
D-
  Top 0.152: J1.B7 6.08,34.56 5.97,34.67 5.21,34.67 5.08,34.55 J1.A7 5.08,32.89 5.46,32.51 6.22,32.51 7.18,31.56 7.18,30.14 U4.4
DTR  (via drill 0.2)
  Top 0.127: U4.23 7.38,27.02 7.82,26.57 v8,26.57
  Bottom 0.152: Q1.1 7.27,26.61 | 7.27,26.61 7.27,26.76 R8.1 | v8,26.57 7.3,26.57 7.27,26.61
FLASH_SCK
  Top 0.127: U2.31 8.13,16.03 8.13,15.22 6.22,13.32 U3.6 6.24,13.08
FLASH_SCS
  Top 0.127: U2.30 7.87,15.72 7.87,15.33 6.34,13.8 5.8,13.8 5.59,13.59 5.59,12.64 5.4,12.45 3.24,12.45 2.79,12 2.79,8.64 3.68,7.75 U3.1
FLASH_SDI
  Top 0.127: U2.33 8.64,16.65 8.64,15.01 7.49,13.87 U3.5
FLASH_SDO
  Top 0.127: U2.32 8.38,16.34 8.38,15.12 6.86,13.6 6.86,12.57 6.48,12.19 3.34,12.19 3.05,11.9 3.05,8.74 3.53,8.26 4.45,8.26 4.95,7.75 U3.2
FLASH_SHD
  Top 0.127: U2.28 7.11,15.35 7.11,14.93 6.24,14.05 5.13,14.05 4.95,13.88 U3.7
FLASH_SWP  (via drill 0.2)
  Top 0.127: U2.29 7.49,15.54 v7.49,15.49 | U3.3 6.22,7.75 6.73,8.26 7.75,8.26 8.06,8.57 v8.06,13.91
  Bottom 0.127: v7.49,15.49 8.06,14.92 v8.06,13.91
FLASH_VDD  (via drill 0.2)
  Top 0.127: U2.26 6.51,14.82 6.51,14.7 6.13,14.32 4.83,14.32 4.32,13.81 4.32,13.28 4.13,13.09 U3.8
  Top 0.152: U3.8 C20.1 | C20.1 C5.1 | C20.1 1.53,13.09 v1.52,13.08
  Bottom 0.152: v1.52,13.08 1.27,12.83 FLASH_VDD.1
GND  (via drill 0.2)
  Top 0.127: C6.2 2.32,22.05 3.14,22.88 v3.14,23.11
  Top 0.152: U4.2 7.86,29.4 v7.87,29.4 | C12.1 8.12,25.47 v8.06,25.53 | v10.16,36.2 10.41,35.94 10.41,33.21 v10.22,33.02 | v1.91,36.2 0.76,36.2 0.25,35.69 0.25,33.27 v0.45,33.08
  Top 0.203: R11.1 9.64,33.02 v10.22,33.02 | v8.26,36.2 8.89,35.56 8.89,34.2 J1.GND | v1.91,36.2 1.75,36.04 1.75,34.23 J1.GND2
  Top 0.254: v0.45,33.08 0.3,32.94 0.3,32.58 0.31,32.57 | C24.2 0.31,32.57 | R6.1 v0.44,30.6 v0.43,30.61 0.31,30.72 0.31,32.57
  Top 0.305: v2.56,38.99 2.69,38.86 2.69,38.51 v2.67,38.48 | OUT.14 2.58,1.7 v2.6,1.71 v2.6,2.16 | OUT.3 8.08,1.26 8.09,1.27 v8.09,1.7 v8.08,1.71 v8.08,2.21 | v8.01,38.48 8.12,38.6 v8.12,38.99 | C23.2 1.91,33.05 2.11,33.26 J1.GND2 | R11.1 9.14,32.93 8.56,33.51 J1.GND | v2.08,8.49 2.08,7.92 D1.GND | v2.21,10.4 2.21,11.07 C5.2
  Bottom 0.152: X2.P2 6.49,18.41 6.6,18.29 7.75,18.29 7.89,18.15 X2.P4
  Bottom 0.254: X2.P2 C9.1 | C4.1 4.7,18.54 | 4.7,18.54 C3.1 | U2.EP 4.7,18.54 | X2.P4 7.49,17.04 C8.1 8.19,16.26 8.45,16 v8.45,14.26
  Bottom 0.305: IN.14 2.58,39.01 v2.56,38.99 2.69,38.86 2.69,38.51 v2.67,38.48 | v2.6,1.71 v2.6,2.16 | v8.09,1.7 8.09,2.2 v8.08,2.21 | IN.3 8.08,39.03 v8.12,38.99 8.12,38.6 v8.01,38.48
  Bottom 0.406: U1.2 v2.86,5.14 v2.86,4.64
  other vias: 4.89,32.51 5.33,27.94 5.33,18.54 3.14,24.23 3.37,25.65 4.38,23.69 7.49,6.73 5.81,31.08 6.03,22.92 1.52,14.1 1.65,15.75 9.32,2.4 8.24,6.08 8.46,11.41 0.81,1.44 3.05,37.53 8.16,27.59 3.8,11.41 7.61,11.41 5.07,8.87 7.61,8.87 6.35,3.49 9.89,1.51 3.68,14.16 5.33,38.1 0.95,17.46
  pour Top (isolate 0.152, rank 3): 0,40.64 10.67,40.64 10.67,0 0,0
  pour Route2 (isolate 0.152, rank 2): 0,40.64 10.67,40.64 10.67,0 0,0
  pour Route15 (isolate 0.152, rank 2): 0,40.64 10.67,40.64 10.67,0 0,0
  pour Bottom (isolate 0.152, rank 2): 0,40.64 10.67,40.64 10.67,0 0,0
  pour Top (isolate 0.102): 0,26.67 5.08,26.67 5.08,19.68 0,19.68
  cutout Bottom (isolate 0.305): 0,29.21 1.65,29.21 1.65,21.59 0,21.59
  cutout Route15 (isolate 0.305): 0,29.21 1.65,29.21 1.65,21.59 0,21.59
  cutout Route2 (isolate 0.305): 0,29.21 1.65,29.21 1.65,21.59 0,21.59
  cutout Top (isolate 0.305): 0,29.21 1.65,29.21 1.65,21.59 0,21.59
GPIO0  (via drill 0.2)
  Top 0.152: U2.16 1.91,16.53 v1.91,16.26
  Top 0.254: OUT.10 4.58,1.67 v4.61,1.69
  Route15 0.127: v4.61,1.69 4.61,1.9 1.09,5.41 1.09,15.82 1.53,16.26 v1.91,16.26 2.74,17.09 2.74,19.1 1.65,20.19 1.65,21.16 2.19,21.69 2.19,32.54 4.59,34.94 4.59,35.55 3.98,36.15 3.98,38.27 4.59,38.88 v4.59,39.18
  Bottom 0.305: IN.10 v4.59,39.18
GPIO1  (via drill 0.2)
  Top 0.152: U2.15 1.5,16.69 v1.47,16.69
  Top 0.305: OUT.11 4.08,1.26 4.09,1.27 4.09,1.42 v4.12,1.46
  Route15 0.127: v4.08,39.18 4.08,38.86 3.7,38.48 3.7,34.48 1.91,32.69 1.91,21.77 1.37,21.24 1.37,20.03 2.4,19.01 2.4,17.61 v1.47,16.69 0.81,16.03 0.81,5.29 4.12,1.98 v4.12,1.46
  Bottom 0.305: IN.11 v4.08,39.18
LED
  Top 0.127: U2.14 0.57,16.32 0.57,11.43 1.95,10.05 D1.DI
N$1
  Top 0.152: J1.A5 6.58,33.04 7.11,32.51 R11.2
N$2  (via drill 0.2)
  Top 0.152: J1.B5 3.58,34.57 v4.19,35.18 | v8.13,30.73 8.13,31.49 R10.2
  Bottom 0.152: v4.19,35.18 5.65,35.18 8.13,32.7 v8.13,30.73
N$3  (via drill 0.2)
  Top 0.127: U2.8 2.46,20.57 2.46,20.7 2.11,21.05 v2.08,21.05
  Bottom 0.127: v2.08,21.05 2.02,21.05 1.7,20.73 1.7,19.84 1.52,19.66 C11.2
N$4  (via drill 0.2)
  Top 0.127: D1.DO 0.85,8.24 1.1,8.5 v1.48,8.5
  Bottom 0.127: v1.48,8.5 1.48,8.79 1.59,8.89 LED_DO.1
N$45
  Bottom 0.152: Q1.5 5.97,25.4 6.1,25.53 6.1,26.93 R8.2
N$46
  Bottom 0.152: Q1.2 6.73,25.4 6.6,25.27 6.6,23.87 R9.2
N$47  (via drill 0.2)
  Top 0.127: U2.45 7.15,21.77 v7.25,21.77
  Bottom 0.127: v7.25,21.77 7.25,21.36 6.84,20.95 5.97,20.95 5.71,20.7 5.71,18.21 X2.P1
  Bottom 0.152: C8.2 X2.P1
N$48  (via drill 0.2)
  Top 0.127: U2.44 7.06,21.05 7.4,21.39 7.58,21.39 8.46,22.28 v8.52,22.28
  Bottom 0.127: v8.52,22.28 8.47,22.28 7.61,21.42 7.61,20.45 C9.2 7.49,19.54 X2.P3
N$50
  Top 0.127: U2.47 6.71,22.46 7.63,22.46 R4.1 C13.2
N$51  (via drill 0.2)
  Top 0.152: R6.2 R5.1 v2.91,29.6 v2.92,29.59 | v3.75,30.39 3.94,30.39 U4.8
  Bottom 0.152: v2.92,29.59 2.94,29.59 v3.75,30.39
N$52
  Top 0.127: R7.1 2.86,31.09 3.3,30.65 3.3,30.23 3.52,30 3.62,30 U4.9
N$53
  Top 0.305: L1.1 C6.1 arc90 2.29,22.99 1.97,22.99 arc90 1.65,22.67 1.65,21.46 1.21,21.02 A1.FEED
N$54  (via drill 0.2)
  Top 0.229: U2.2 3.74,22.68
  Top 0.305: 3.74,22.68 arc-45 3.62,22.97 3.62,24.48 arc90 v3.14,24.96 L1.2 arc90 L1.2
  Bottom 0.305: v3.14,24.96 2.96,24.77 C7.1
PROC_PWR_EN  (via drill 0.2)
  Top 0.305: v9.08,1.46 OUT.1
  Route15 0.127: v4.7,2.38 4.66,2.42 4.48,2.42 2.48,4.42 v2.48,6.1 | v9.72,40.07 9.02,39.37 9.02,32.99 10.19,31.81 10.19,2.57 v9.08,1.46
  Bottom 0.127: v9.08,1.46 9.08,1.99 8.48,2.58 4.9,2.58 v4.7,2.38 | v2.48,6.1 v2.47,6.09
  Bottom 0.152: IN.1 9.54,39.9 v9.72,40.07 | R1.1 2.28,6.8 2.48,6.6 v2.48,6.1 U1.3
RTS  (via drill 0.2)
  Top 0.127: v6.13,24.77 6.32,24.96 6.32,25.19 U4.19
  Bottom 0.127: v6.13,24.77 6.11,24.75 Q1.4
  Bottom 0.152: R9.1 5.43,24.04 Q1.4
RXT  (via drill 0.2)
  Top 0.127: U4.13 2.76,27.61 2.76,27.84 v2.86,27.94
  Bottom 0.152: v2.86,27.94 3.62,27.94 3.81,28.13 RXT.1
SCL  (via drill 0.2)
  Top 0.127: U2.39 8.94,20.16 v8.94,20.23 9.47,20.76 9.47,28.61 v7.99,30.1
  Top 0.305: OUT.13 3.08,1.43 v3.12,1.46
  Route15 0.127: v7.99,30.1 7.74,30.35 7.74,31.67 5.42,33.99 5.42,36.24 v4.76,36.89
  Bottom 0.127: v3.12,1.46 3.12,1.7 4.51,3.09 9.34,3.09 9.91,3.66 9.91,19.97 9.65,20.23 v8.94,20.23
  Bottom 0.152: v4.76,36.89 3.07,38.58 IN.13
  Bottom 0.305: IN.13
SCLK  (via drill 0.2)
  Top 0.127: v9.51,16.92 v9.5,16.92 U2.35
  Top 0.305: v7.62,1.46 7.58,1.43 OUT.4
  Route15 0.127: v7.62,39.18 v7.62,39.17 7.62,34 9.94,31.69 9.94,17.34 9.52,16.92 v9.51,16.92 9.91,16.53 9.91,4.56 7.61,2.27 7.61,1.47 v7.62,1.46
  Bottom 0.305: v7.62,39.18 7.58,39.21 IN.4
SDA  (via drill 0.2)
  Top 0.127: U2.42 8.35,21.27 v8.49,21.27
  Top 0.305: OUT.12 3.58,1.43 v3.62,1.46
  Route15 0.127: v8.49,21.27 8.22,21.27 8.13,21.37 8.13,22.45 8.57,22.89 8.57,31.23 5.7,34.1 5.7,36.53 v4.76,37.47
  Bottom 0.127: v3.62,1.46 3.62,1.84 4.62,2.84 9.44,2.84 10.16,3.56 10.16,20.45 9.4,21.21 8.55,21.21 v8.49,21.27
  Bottom 0.152: v4.76,37.47 3.58,38.65 IN.12
TXT  (via drill 0.2)
  Top 0.152: U4.14 3.35,26.98 v2.86,26.48
  Bottom 0.152: v2.86,26.48 3.05,26.67 TXT.1
U0RXD
  Top 0.127: U4.21 7.04,25.88 7.52,25.88 7.8,26.16 8.36,26.16 9.22,25.3 9.22,20.98 8.85,20.61 8.75,20.61 8.13,19.98 U2.40
U0TXD
  Top 0.127: U2.41 7.84,20.23 8.47,20.86 8.71,20.86 8.97,21.11 8.97,25.16 8.22,25.91 7.91,25.91 7.5,25.5 6.72,25.5 U4.20
USB_3V3  (via drill 0.2)
  Top 0.152: C22.1 | C22.1 4.65,31.63 3.94,31.63 C21.1 2.87,32.57 R7.2 | C22.1 4.83,31.34 U4.6 6.42,30.8 v6.78,30.8 6.78,30.45 U4.5
  Bottom 0.152: v6.78,30.8 6.78,31.32 USB_3V3.1
V_USB  (via drill 0.2)
  Top 0.152: v4.19,30.86 4.77,30.28 U4.7
  Top 0.305: OUT.16 v1.59,1.46 v1.59,1.96 | v2.86,30.23 2.48,30.6 R5.2 C23.1 C24.1 | J1.VBUS2 2.88,34.51 3.11,34.73 3.11,35.69 | v1.97,37.91 v1.97,37.4 3.11,36.26 3.11,35.69 | J1.VBUS1 7.78,34.51 6.6,35.69 3.11,35.69
  Route15 0.305: v0.51,40.07 v0.95,40.07 1.27,40.07 1.63,39.71 1.63,38.29 1.97,37.95 v1.97,37.91 v1.97,37.4
  Bottom 0.305: 0.33,3.05 0.33,2.2 0.57,1.96 v1.59,1.96 v1.59,1.46 | IN.16 1.13,39.9 v0.95,40.07 v0.51,40.07 | v1.97,37.91 v1.97,37.4 3.3,36.07 3.3,34.61 2.86,34.16 2.86,30.86 | v4.19,30.86 2.86,30.86 | 2.86,30.86 v2.86,30.23 1.86,29.23 1.86,21.91 1.26,21.3 0.6,21.3 0.33,21.03 0.33,7.3 | C1.1 0.33,3.05 | R1.2 0.33,7.3 | 0.33,3.05 0.33,4.19 | 0.33,4.19 0.33,7.3 | U1.1 0.33,4.19
  Bottom 0.406: U1.1

### Text on the board
Bottom: X01
Measures: Dimensions in Inches
tDocu: JLCPCB JLC7628 4-Layer 1.2mm Impedance Control / 4-Layer Board / 1.2mm Thickness / 1oz Copper (Outer layers) / ENIG Finish | Populate the bottom layer components first to avoid problems placing the IN / connector if the USB-C connector solder paste leaks out of the bottom of the / routed holes | Paul Clark